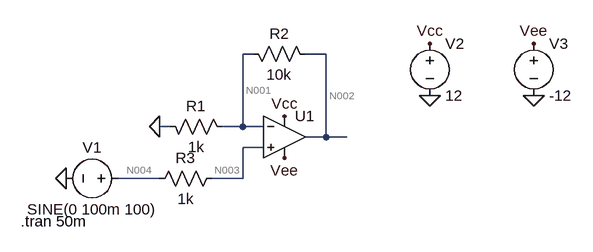
[diagram p0: schematic Amplificato_Neinversor_AO.asc]
Amplificato_Neinversor_AO.asc, the LTspice schematic file:
Version 4
SHEET 1 880 680
WIRE 160 48 144 48
WIRE 272 48 240 48
WIRE 32 160 16 160
WIRE 144 160 144 48
WIRE 144 160 112 160
WIRE 176 160 144 160
WIRE 272 176 272 48
WIRE 272 176 240 176
WIRE 304 176 272 176
WIRE 176 192 144 192
WIRE 16 240 -48 240
WIRE 144 240 144 192
WIRE 144 240 96 240
FLAG 16 160 0
FLAG -128 240 0
FLAG 432 112 0
FLAG 592 112 0
FLAG 432 32 Vcc
FLAG 208 144 Vcc
FLAG 592 32 Vee
FLAG 208 208 Vee
SYMBOL voltage -32 240 R90
WINDOW 0 -32 56 VBottom 2
WINDOW 3 32 56 VTop 2
WINDOW 123 0 0 Left 0
WINDOW 39 0 0 Left 0
SYMATTR InstName V1
SYMATTR Value SINE(0 100m 100)
SYMBOL res 16 144 M90
WINDOW 0 0 56 VBottom 2
WINDOW 3 32 56 VTop 2
SYMATTR InstName R1
SYMATTR Value 1k
SYMBOL res 144 32 M90
WINDOW 0 0 56 VBottom 2
WINDOW 3 32 56 VTop 2
SYMATTR InstName R2
SYMATTR Value 10k
SYMBOL OpAmps\\UniversalOpAmp1 208 176 R0
SYMATTR InstName U1
SYMBOL voltage 432 16 R0
WINDOW 123 0 0 Left 0
WINDOW 39 0 0 Left 0
SYMATTR InstName V2
SYMATTR Value 12
SYMBOL voltage 592 16 R0
WINDOW 123 0 0 Left 0
WINDOW 39 0 0 Left 0
SYMATTR InstName V3
SYMATTR Value -12
SYMBOL res 112 224 R90
WINDOW 0 0 56 VBottom 2
WINDOW 3 32 56 VTop 2
SYMATTR InstName R3
SYMATTR Value 1k
TEXT -198 306 Left 2 !.tran 50m

The netlist it stands for:
* Amplificato_Neinversor_AO.asc
V1 N004 0 SINE(0 100m 100)
R1 0 N001 1k
R2 N001 N002 10k
XU1 N003 N001 Vcc Vee N002 level1 Avol=1Meg GBW=10Meg Vos=0 En=0 Enk=0 In=0 Ink=0 Rin=500Meg  ; pins In+ In- V+ V- OUT
V2 Vcc 0 12
V3 Vee 0 -12
R3 N003 N004 1k
.tran 50m
.lib UniversalOpAmp1.lib
.backanno
.end

* Results of the author's LTspice run, read from the files saved beside the schematic
* Operating Point, zero values left out:
*   V(vcc) = 12 V
*   V(vee) = -12 V
*   I(V3) = 24 nA
*   I(V2) = -24 nA
*   Ix(u1:3) = 24 nA
*   Ix(u1:4) = -24 nA
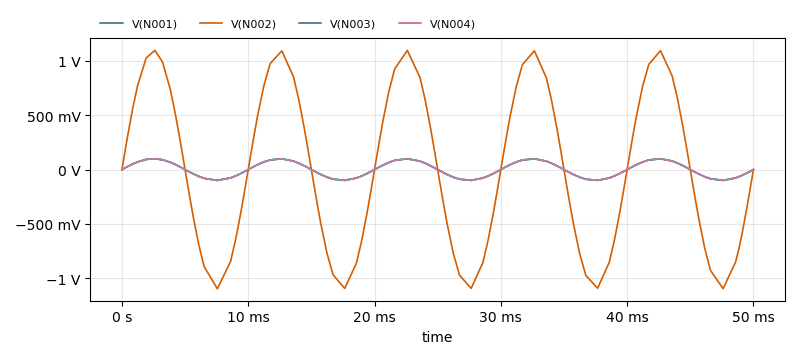
[diagram p1: Transient Analysis of Amplificato_Neinversor_AO.asc, plotted from the saved traces]
* Transient Analysis, 1 run:
*   V(N001): min -99.8 mV, max 99.77 mV, average 74.9 µV, rms 69.55 mV, last -11 µV
*   V(N002): min -1.098 V, max 1.097 V, average 823.9 µV, rms 765.1 mV, last -121 µV
*   V(N003): min -99.8 mV, max 99.77 mV, average 74.9 µV, rms 69.56 mV, last 0 V
*   V(N004): min -99.82 mV, max 99.79 mV, average 74.92 µV, rms 69.57 mV, last 0 V